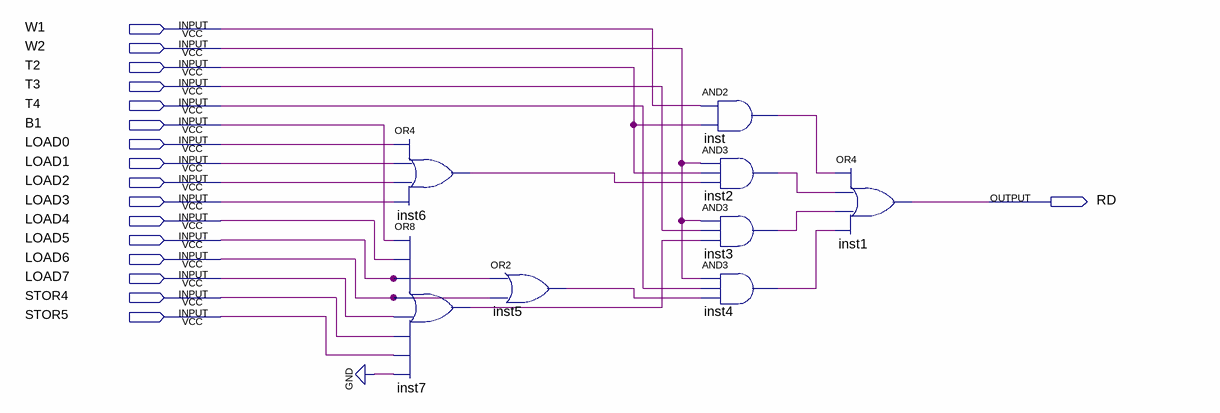
[diagram p0: schematic sheet]
// Quartus schematic RD.bdf as structural Verilog: 8 symbols, 17 pins
module RD (
  input  W1,
  input  W2,
  input  T2,
  input  T3,
  input  T4,
  input  B1,
  input  LOAD0,
  input  LOAD1,
  input  LOAD2,
  input  LOAD3,
  input  LOAD4,
  input  LOAD5,
  input  LOAD6,
  input  LOAD7,
  input  STOR4,
  input  STOR5,
  output RD
);

  wire inst2_out, inst3_out, inst4_out, inst5_out, inst6_out, inst7_out, inst_out;

  or inst6 (inst6_out, LOAD0, LOAD1, LOAD2, LOAD3);
  or inst7 (inst7_out, B1, LOAD4, LOAD5, LOAD6, LOAD7, STOR4, STOR5, 1'b0);
  or inst5 (inst5_out, LOAD5, LOAD6);
  and inst (inst_out, W1, T2);
  and inst2 (inst2_out, W2, T2, inst6_out);
  and inst3 (inst3_out, W2, T3, inst7_out);
  and inst4 (inst4_out, W2, T4, inst5_out);
  or inst1 (RD, inst_out, inst2_out, inst3_out, inst4_out);
endmodule
